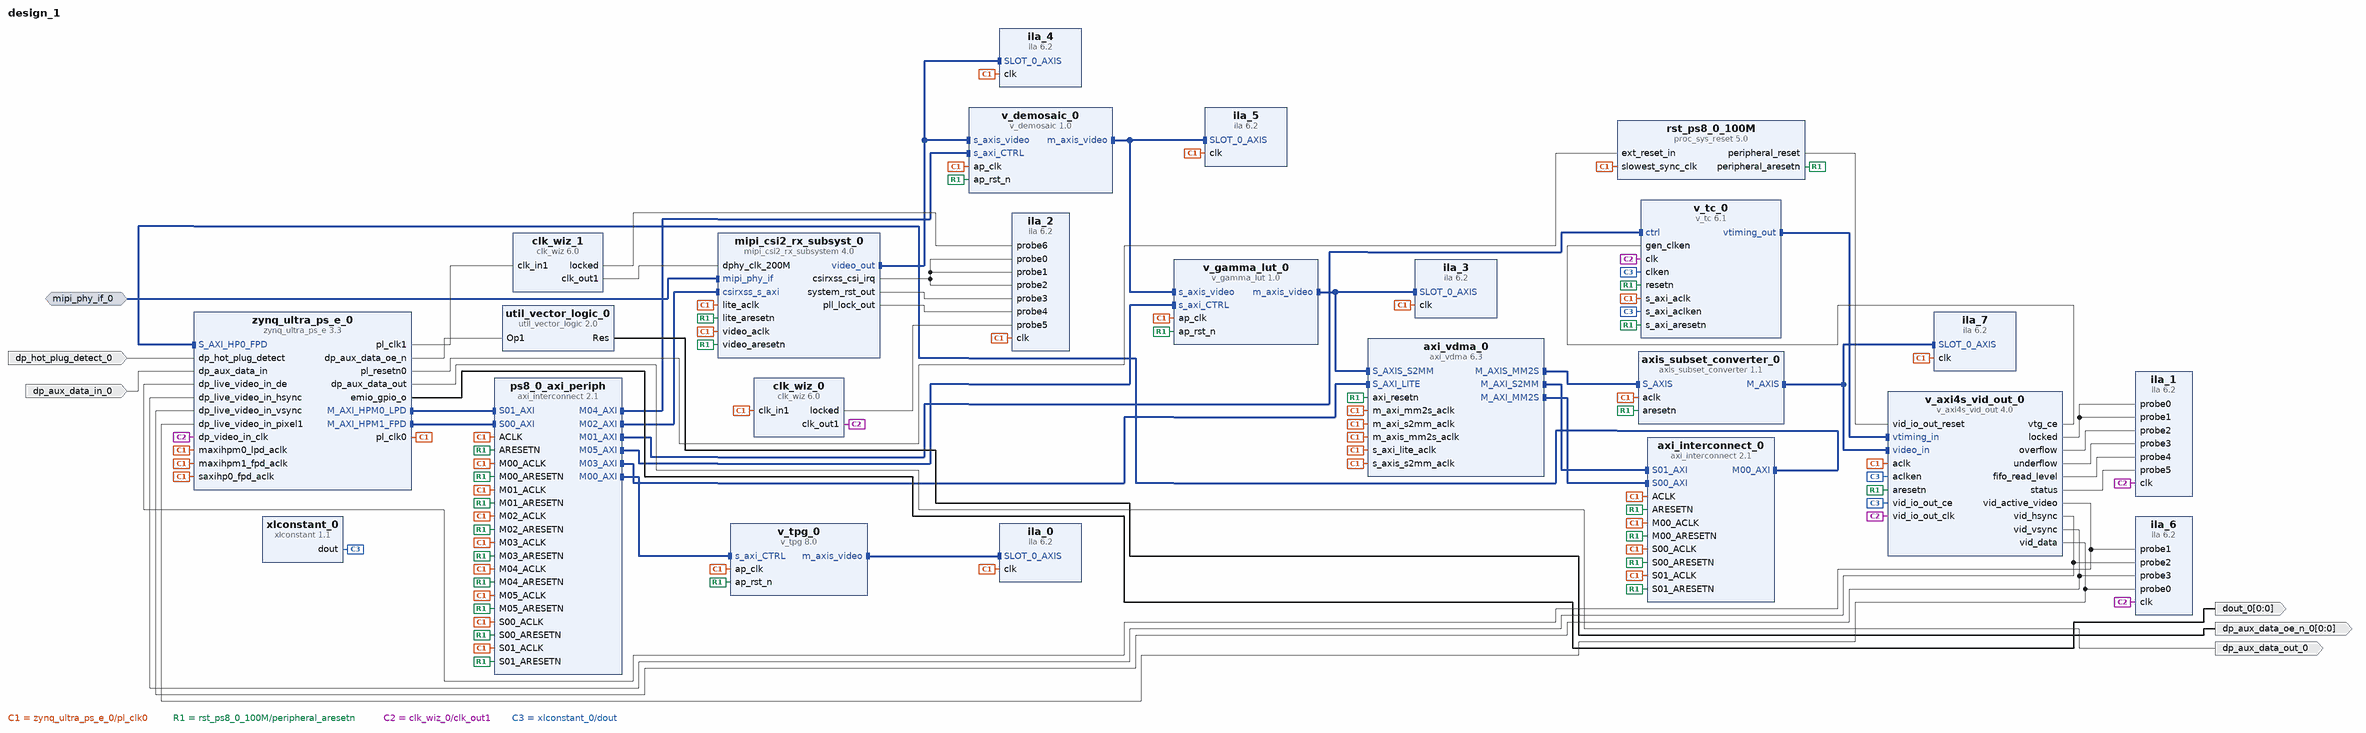
[diagram p0: block diagram of the top level]
# Vivado block design design_1, xczu3eg-sfvc784-1-e, Vivado 2019.1
create_bd_design design_1

create_bd_intf_port -mode Slave -vlnv xilinx.com:interface:mipi_phy_rtl:1.0 mipi_phy_if_0
create_bd_port -dir I dp_hot_plug_detect_0
create_bd_port -dir I dp_aux_data_in_0
create_bd_port -dir O dp_aux_data_out_0
create_bd_port -dir O -from 0 -to 0 dp_aux_data_oe_n_0
create_bd_port -dir O -from 0 -to 0 dout_0

create_bd_cell -type ip -vlnv xilinx.com:ip:clk_wiz:6.0 clk_wiz_0
set_property -dict [list \
  CONFIG.CLKIN1_JITTER_PS 66.66000000000001 \
  CONFIG.CLKOUT1_DRIVES Buffer \
  CONFIG.CLKOUT1_JITTER 220.922 \
  CONFIG.CLKOUT1_PHASE_ERROR 336.765 \
  CONFIG.CLKOUT1_REQUESTED_OUT_FREQ 74.250 \
  CONFIG.CLKOUT2_DRIVES Buffer \
  CONFIG.CLKOUT2_JITTER 151.155 \
  CONFIG.CLKOUT2_PHASE_ERROR 280.366 \
  CONFIG.CLKOUT2_REQUESTED_OUT_FREQ 200.000 \
  CONFIG.CLKOUT2_USED false \
  CONFIG.CLKOUT3_DRIVES Buffer \
  CONFIG.CLKOUT4_DRIVES Buffer \
  CONFIG.CLKOUT5_DRIVES Buffer \
  CONFIG.CLKOUT6_DRIVES Buffer \
  CONFIG.CLKOUT7_DRIVES Buffer \
  CONFIG.FEEDBACK_SOURCE FDBK_AUTO \
  CONFIG.MMCM_BANDWIDTH OPTIMIZED \
  CONFIG.MMCM_CLKFBOUT_MULT_F 61.875 \
  CONFIG.MMCM_CLKIN1_PERIOD 6.667 \
  CONFIG.MMCM_CLKIN2_PERIOD 10.0 \
  CONFIG.MMCM_CLKOUT0_DIVIDE_F 15.625 \
  CONFIG.MMCM_CLKOUT1_DIVIDE 1 \
  CONFIG.MMCM_COMPENSATION AUTO \
  CONFIG.MMCM_DIVCLK_DIVIDE 8 \
  CONFIG.NUM_OUT_CLKS 1 \
  CONFIG.PRIMITIVE MMCM \
  CONFIG.PRIM_IN_FREQ 150.000 \
  CONFIG.USE_RESET false \
] [get_bd_cells clk_wiz_0]
create_bd_cell -type ip -vlnv xilinx.com:ip:ila:6.2 ila_1
set_property -dict [list \
  CONFIG.C_ENABLE_ILA_AXI_MON false \
  CONFIG.C_MONITOR_TYPE Native \
  CONFIG.C_NUM_OF_PROBES 6 \
  CONFIG.C_PROBE4_WIDTH 11 \
  CONFIG.C_PROBE5_WIDTH 32 \
] [get_bd_cells ila_1]
create_bd_cell -type ip -vlnv xilinx.com:ip:axi_interconnect:2.1 ps8_0_axi_periph
set_property -dict {CONFIG.NUM_MI 6 CONFIG.NUM_SI 2} [get_bd_cells ps8_0_axi_periph]
create_bd_cell -type ip -vlnv xilinx.com:ip:proc_sys_reset:5.0 rst_ps8_0_100M
create_bd_cell -type ip -vlnv xilinx.com:ip:v_axi4s_vid_out:4.0 v_axi4s_vid_out_0
set_property -dict [list \
  CONFIG.C_ADDR_WIDTH 12 \
  CONFIG.C_HAS_ASYNC_CLK 1 \
  CONFIG.C_HYSTERESIS_LEVEL 12 \
  CONFIG.C_NATIVE_COMPONENT_WIDTH 12 \
  CONFIG.C_S_AXIS_VIDEO_DATA_WIDTH 10 \
  CONFIG.C_VTG_MASTER_SLAVE 0 \
] [get_bd_cells v_axi4s_vid_out_0]
create_bd_cell -type ip -vlnv xilinx.com:ip:v_tc:6.1 v_tc_0
set_property -dict {CONFIG.enable_detection false CONFIG.enable_generation true} [get_bd_cells v_tc_0]
create_bd_cell -type ip -vlnv xilinx.com:ip:v_tpg:8.0 v_tpg_0
set_property -dict {CONFIG.FOREGROUND 0 CONFIG.HAS_AXI4S_SLAVE 0 CONFIG.ZONE_PLATE 1} [get_bd_cells v_tpg_0]
create_bd_cell -type ip -vlnv xilinx.com:ip:xlconstant:1.1 xlconstant_0
create_bd_cell -type ip -vlnv xilinx.com:ip:zynq_ultra_ps_e:3.3 zynq_ultra_ps_e_0
set_property -dict [list \
  CONFIG.PSU_BANK_0_IO_STANDARD LVCMOS33 \
  CONFIG.PSU_BANK_1_IO_STANDARD LVCMOS18 \
  CONFIG.PSU_BANK_2_IO_STANDARD LVCMOS18 \
  CONFIG.PSU_BANK_3_IO_STANDARD LVCMOS33 \
  CONFIG.PSU_USB3__DUAL_CLOCK_ENABLE 1 \
  CONFIG.PSU__CRF_APB__DDR_CTRL__FREQMHZ 933 \
  CONFIG.PSU__CRF_APB__DPDMA_REF_CTRL__SRCSEL APLL \
  CONFIG.PSU__CRF_APB__DP_AUDIO_REF_CTRL__SRCSEL RPLL \
  CONFIG.PSU__CRF_APB__DP_STC_REF_CTRL__SRCSEL RPLL \
  CONFIG.PSU__CRF_APB__DP_VIDEO_REF_CTRL__SRCSEL VPLL \
  CONFIG.PSU__CRF_APB__GDMA_REF_CTRL__SRCSEL APLL \
  CONFIG.PSU__CRF_APB__GPU_REF_CTRL__SRCSEL IOPLL \
  CONFIG.PSU__CRF_APB__TOPSW_MAIN_CTRL__SRCSEL DPLL \
  CONFIG.PSU__CRL_APB__PL0_REF_CTRL__FREQMHZ 150 \
  CONFIG.PSU__CRL_APB__PL0_REF_CTRL__SRCSEL IOPLL \
  CONFIG.PSU__CRL_APB__PL1_REF_CTRL__FREQMHZ 50 \
  CONFIG.PSU__CRL_APB__PL1_REF_CTRL__SRCSEL IOPLL \
  CONFIG.PSU__CRL_APB__SDIO1_REF_CTRL__SRCSEL IOPLL \
  CONFIG.PSU__CRL_APB__USB3__ENABLE 1 \
  CONFIG.PSU__DDRC__COMPONENTS UDIMM \
  CONFIG.PSU__DDRC__DEVICE_CAPACITY {4096 MBits} \
  CONFIG.PSU__DDRC__SPEED_BIN DDR4_1866L \
  CONFIG.PSU__DDR_HIGH_ADDRESS_GUI_ENABLE 1 \
  CONFIG.PSU__DDR__INTERFACE__FREQMHZ 466.500 \
  CONFIG.PSU__DISPLAYPORT__LANE0__ENABLE 1 \
  CONFIG.PSU__DISPLAYPORT__LANE0__IO {GT Lane3} \
  CONFIG.PSU__DISPLAYPORT__LANE1__ENABLE 1 \
  CONFIG.PSU__DISPLAYPORT__LANE1__IO {GT Lane2} \
  CONFIG.PSU__DISPLAYPORT__PERIPHERAL__ENABLE 1 \
  CONFIG.PSU__DLL__ISUSED 1 \
  CONFIG.PSU__DPAUX__PERIPHERAL__ENABLE 1 \
  CONFIG.PSU__DPAUX__PERIPHERAL__IO EMIO \
  CONFIG.PSU__DP__LANE_SEL {Dual Higher} \
  CONFIG.PSU__DP__REF_CLK_FREQ 108 \
  CONFIG.PSU__DP__REF_CLK_SEL {Ref Clk2} \
  CONFIG.PSU__ENET0__GRP_MDIO__ENABLE 1 \
  CONFIG.PSU__ENET0__GRP_MDIO__IO {MIO 76 .. 77} \
  CONFIG.PSU__ENET0__PERIPHERAL__ENABLE 1 \
  CONFIG.PSU__ENET0__PERIPHERAL__IO {MIO 26 .. 37} \
  CONFIG.PSU__FPGA_PL1_ENABLE 1 \
  CONFIG.PSU__GEM__TSU__ENABLE 0 \
  CONFIG.PSU__GPIO0_MIO__IO {MIO 0 .. 25} \
  CONFIG.PSU__GPIO0_MIO__PERIPHERAL__ENABLE 1 \
  CONFIG.PSU__GPIO1_MIO__IO {MIO 26 .. 51} \
  CONFIG.PSU__GPIO1_MIO__PERIPHERAL__ENABLE 1 \
  CONFIG.PSU__GPIO_EMIO__PERIPHERAL__ENABLE 1 \
  CONFIG.PSU__GPIO_EMIO__PERIPHERAL__IO 1 \
  CONFIG.PSU__GT__LINK_SPEED HBR \
  CONFIG.PSU__GT__PRE_EMPH_LVL_4 0 \
  CONFIG.PSU__GT__VLT_SWNG_LVL_4 0 \
  CONFIG.PSU__I2C0__PERIPHERAL__ENABLE 1 \
  CONFIG.PSU__I2C0__PERIPHERAL__IO {MIO 22 .. 23} \
  CONFIG.PSU__I2C1__PERIPHERAL__ENABLE 1 \
  CONFIG.PSU__I2C1__PERIPHERAL__IO {MIO 8 .. 9} \
  CONFIG.PSU__PCIE__BAR0_VAL 0x0 \
  CONFIG.PSU__PCIE__BAR1_VAL 0x0 \
  CONFIG.PSU__PCIE__BAR2_VAL 0x0 \
  CONFIG.PSU__PCIE__BAR3_VAL 0x0 \
  CONFIG.PSU__PCIE__BAR4_VAL 0x0 \
  CONFIG.PSU__PCIE__BAR5_VAL 0x0 \
  CONFIG.PSU__PCIE__CLASS_CODE_BASE 0x06 \
  CONFIG.PSU__PCIE__CLASS_CODE_INTERFACE 0x0 \
  CONFIG.PSU__PCIE__CLASS_CODE_SUB 0x04 \
  CONFIG.PSU__PCIE__CLASS_CODE_VALUE 0x60400 \
  CONFIG.PSU__PCIE__DEVICE_ID 0xD011 \
  CONFIG.PSU__PCIE__DEVICE_PORT_TYPE {Root Port} \
  CONFIG.PSU__PCIE__EROM_VAL 0x0 \
  CONFIG.PSU__PCIE__LANE0__ENABLE 1 \
  CONFIG.PSU__PCIE__LANE0__IO {GT Lane0} \
  CONFIG.PSU__PCIE__LINK_SPEED {5.0 Gb/s} \
  CONFIG.PSU__PCIE__MAXIMUM_LINK_WIDTH x1 \
  CONFIG.PSU__PCIE__MAX_PAYLOAD_SIZE {256 bytes} \
  CONFIG.PSU__PCIE__PERIPHERAL__ENABLE 1 \
  CONFIG.PSU__PCIE__PERIPHERAL__ENDPOINT_ENABLE 0 \
  CONFIG.PSU__PCIE__PERIPHERAL__ROOTPORT_ENABLE 1 \
  CONFIG.PSU__PCIE__PERIPHERAL__ROOTPORT_IO {MIO 7} \
  CONFIG.PSU__PCIE__REF_CLK_FREQ 100 \
  CONFIG.PSU__PCIE__REF_CLK_SEL {Ref Clk0} \
  CONFIG.PSU__PCIE__REVISION_ID 0x0 \
  CONFIG.PSU__PCIE__SUBSYSTEM_ID 0x7 \
  CONFIG.PSU__PCIE__SUBSYSTEM_VENDOR_ID 0x10EE \
  CONFIG.PSU__PCIE__VENDOR_ID 0x10EE \
  CONFIG.PSU__PRESET_APPLIED 1 \
  CONFIG.PSU__PSS_REF_CLK__FREQMHZ 30 \
  CONFIG.PSU__QSPI_COHERENCY 0 \
  CONFIG.PSU__QSPI_ROUTE_THROUGH_FPD 0 \
  CONFIG.PSU__QSPI__GRP_FBCLK__ENABLE 1 \
  CONFIG.PSU__QSPI__GRP_FBCLK__IO {MIO 6} \
  CONFIG.PSU__QSPI__PERIPHERAL__DATA_MODE x4 \
  CONFIG.PSU__QSPI__PERIPHERAL__ENABLE 1 \
  CONFIG.PSU__QSPI__PERIPHERAL__IO {MIO 0 .. 5} \
  CONFIG.PSU__QSPI__PERIPHERAL__MODE Single \
  CONFIG.PSU__SD1_COHERENCY 0 \
  CONFIG.PSU__SD1_ROUTE_THROUGH_FPD 0 \
  CONFIG.PSU__SD1__DATA_TRANSFER_MODE 8Bit \
  CONFIG.PSU__SD1__GRP_CD__ENABLE 1 \
  CONFIG.PSU__SD1__GRP_CD__IO {MIO 45} \
  CONFIG.PSU__SD1__GRP_POW__ENABLE 1 \
  CONFIG.PSU__SD1__GRP_POW__IO {MIO 43} \
  CONFIG.PSU__SD1__GRP_WP__ENABLE 0 \
  CONFIG.PSU__SD1__PERIPHERAL__ENABLE 1 \
  CONFIG.PSU__SD1__PERIPHERAL__IO {MIO 39 .. 51} \
  CONFIG.PSU__SD1__SLOT_TYPE {SD 3.0} \
  CONFIG.PSU__SPI0__GRP_SS0__IO {MIO 15} \
  CONFIG.PSU__SPI0__GRP_SS1__ENABLE 1 \
  CONFIG.PSU__SPI0__GRP_SS1__IO {MIO 14} \
  CONFIG.PSU__SPI0__PERIPHERAL__ENABLE 1 \
  CONFIG.PSU__SPI0__PERIPHERAL__IO {MIO 12 .. 17} \
  CONFIG.PSU__TSU__BUFG_PORT_PAIR 0 \
  CONFIG.PSU__TTC0__CLOCK__ENABLE 0 \
  CONFIG.PSU__TTC0__PERIPHERAL__ENABLE 1 \
  CONFIG.PSU__TTC0__WAVEOUT__ENABLE 0 \
  CONFIG.PSU__UART0__BAUD_RATE 115200 \
  CONFIG.PSU__UART0__MODEM__ENABLE 0 \
  CONFIG.PSU__UART0__PERIPHERAL__ENABLE 1 \
  CONFIG.PSU__UART0__PERIPHERAL__IO {MIO 18 .. 19} \
  CONFIG.PSU__UART1__BAUD_RATE 115200 \
  CONFIG.PSU__UART1__MODEM__ENABLE 0 \
  CONFIG.PSU__UART1__PERIPHERAL__ENABLE 1 \
  CONFIG.PSU__UART1__PERIPHERAL__IO EMIO \
  CONFIG.PSU__USB0_COHERENCY 0 \
  CONFIG.PSU__USB0__PERIPHERAL__ENABLE 1 \
  CONFIG.PSU__USB0__PERIPHERAL__IO {MIO 52 .. 63} \
  CONFIG.PSU__USB0__REF_CLK_FREQ 100 \
  CONFIG.PSU__USB0__REF_CLK_SEL {Ref Clk0} \
  CONFIG.PSU__USB1__PERIPHERAL__ENABLE 1 \
  CONFIG.PSU__USB1__PERIPHERAL__IO {MIO 64 .. 75} \
  CONFIG.PSU__USB2_0__EMIO__ENABLE 0 \
  CONFIG.PSU__USB3_0__EMIO__ENABLE 0 \
  CONFIG.PSU__USB3_0__PERIPHERAL__ENABLE 1 \
  CONFIG.PSU__USB3_0__PERIPHERAL__IO {GT Lane1} \
  CONFIG.PSU__USB__RESET__MODE Disable \
  CONFIG.PSU__USE__IRQ0 1 \
  CONFIG.PSU__USE__M_AXI_GP1 1 \
  CONFIG.PSU__USE__S_AXI_GP2 1 \
  CONFIG.PSU__USE__VIDEO 1 \
  CONFIG.SUBPRESET1 Custom \
] [get_bd_cells zynq_ultra_ps_e_0]
# 194 more settings of zynq_ultra_ps_e_0 are not shown: defaults, MIO pin electricals, DDR timing, and values the tool derives
create_bd_cell -type ip -vlnv xilinx.com:ip:util_vector_logic:2.0 util_vector_logic_0
set_property -dict {CONFIG.C_OPERATION not CONFIG.C_SIZE 1} [get_bd_cells util_vector_logic_0]
create_bd_cell -type ip -vlnv xilinx.com:ip:mipi_csi2_rx_subsystem:4.0 mipi_csi2_rx_subsyst_0
set_property -dict [list \
  CONFIG.CLK_LANE_IO_LOC G1 \
  CONFIG.CMN_INC_VFB true \
  CONFIG.CMN_NUM_LANES 2 \
  CONFIG.CMN_PXL_FORMAT RAW10 \
  CONFIG.C_CSI_EN_ACTIVELANES true \
  CONFIG.C_DPHY_LANES 2 \
  CONFIG.C_EN_CSI_V2_0 true \
  CONFIG.C_HS_LINE_RATE 280 \
  CONFIG.C_HS_SETTLE_NS 170 \
  CONFIG.DATA_LANE0_IO_LOC E1 \
  CONFIG.DATA_LANE1_IO_LOC F2 \
  CONFIG.DPY_LINE_RATE 280 \
  CONFIG.HP_IO_BANK_SELECTION 66 \
  CONFIG.SupportLevel 1 \
] [get_bd_cells mipi_csi2_rx_subsyst_0]
create_bd_cell -type ip -vlnv xilinx.com:ip:ila:6.2 ila_2
set_property -dict {CONFIG.C_ENABLE_ILA_AXI_MON false CONFIG.C_MONITOR_TYPE Native CONFIG.C_NUM_OF_PROBES 7} [get_bd_cells ila_2]
create_bd_cell -type ip -vlnv xilinx.com:ip:ila:6.2 ila_3
set_property -dict {CONFIG.C_NUM_OF_PROBES 9 CONFIG.C_SLOT_0_AXI_PROTOCOL AXI4S} [get_bd_cells ila_3]
create_bd_cell -type ip -vlnv xilinx.com:ip:clk_wiz:6.0 clk_wiz_1
set_property -dict [list \
  CONFIG.CLKOUT1_JITTER 124.134 \
  CONFIG.CLKOUT1_REQUESTED_OUT_FREQ 200.000 \
  CONFIG.MMCM_CLKOUT0_DIVIDE_F 6.000 \
  CONFIG.USE_RESET false \
] [get_bd_cells clk_wiz_1]
create_bd_cell -type ip -vlnv xilinx.com:ip:axi_vdma:6.3 axi_vdma_0
set_property -dict [list \
  CONFIG.c_include_mm2s_dre 1 \
  CONFIG.c_include_s2mm_dre 1 \
  CONFIG.c_m_axis_mm2s_tdata_width 32 \
  CONFIG.c_mm2s_linebuffer_depth 2048 \
  CONFIG.c_mm2s_max_burst_length 64 \
  CONFIG.c_num_fstores 1 \
  CONFIG.c_s2mm_linebuffer_depth 2048 \
  CONFIG.c_s2mm_max_burst_length 64 \
  CONFIG.c_use_s2mm_fsync 0 \
] [get_bd_cells axi_vdma_0]
create_bd_cell -type ip -vlnv xilinx.com:ip:axi_interconnect:2.1 axi_interconnect_0
set_property -dict {CONFIG.NUM_MI 1 CONFIG.NUM_SI 2} [get_bd_cells axi_interconnect_0]
create_bd_cell -type ip -vlnv xilinx.com:ip:ila:6.2 ila_0
set_property -dict {CONFIG.C_DATA_DEPTH 2048 CONFIG.C_NUM_OF_PROBES 9 CONFIG.C_SLOT_0_AXI_PROTOCOL AXI4S} [get_bd_cells ila_0]
create_bd_cell -type ip -vlnv xilinx.com:ip:v_demosaic:1.0 v_demosaic_0
set_property -dict [list \
  CONFIG.ALGORITHM 1 \
  CONFIG.MAX_COLS 2048 \
  CONFIG.MAX_DATA_WIDTH 10 \
  CONFIG.MAX_ROWS 1024 \
] [get_bd_cells v_demosaic_0]
create_bd_cell -type ip -vlnv xilinx.com:ip:v_gamma_lut:1.0 v_gamma_lut_0
set_property -dict {CONFIG.MAX_COLS 2048 CONFIG.MAX_DATA_WIDTH 10 CONFIG.MAX_ROWS 1024} [get_bd_cells v_gamma_lut_0]
create_bd_cell -type ip -vlnv xilinx.com:ip:axis_subset_converter:1.1 axis_subset_converter_0
set_property -dict {CONFIG.TDATA_REMAP {tdata[31:30],tdata[19:10],tdata[29:20],tdata[9:0]}} [get_bd_cells axis_subset_converter_0]
create_bd_cell -type ip -vlnv xilinx.com:ip:ila:6.2 ila_4
set_property -dict {CONFIG.C_DATA_DEPTH 2048 CONFIG.C_NUM_OF_PROBES 9 CONFIG.C_SLOT_0_AXI_PROTOCOL AXI4S} [get_bd_cells ila_4]
create_bd_cell -type ip -vlnv xilinx.com:ip:ila:6.2 ila_5
set_property -dict {CONFIG.C_DATA_DEPTH 2048 CONFIG.C_NUM_OF_PROBES 9 CONFIG.C_SLOT_0_AXI_PROTOCOL AXI4S} [get_bd_cells ila_5]
create_bd_cell -type ip -vlnv xilinx.com:ip:ila:6.2 ila_6
set_property -dict [list \
  CONFIG.C_ENABLE_ILA_AXI_MON false \
  CONFIG.C_MONITOR_TYPE Native \
  CONFIG.C_NUM_OF_PROBES 4 \
  CONFIG.C_PROBE0_WIDTH 36 \
] [get_bd_cells ila_6]
create_bd_cell -type ip -vlnv xilinx.com:ip:ila:6.2 ila_7
set_property -dict {CONFIG.C_DATA_DEPTH 2048 CONFIG.C_NUM_OF_PROBES 9 CONFIG.C_SLOT_0_AXI_PROTOCOL AXI4S} [get_bd_cells ila_7]

# ---- connections ----

connect_bd_intf_net [get_bd_intf_pins axi_vdma_0/M_AXI_S2MM] [get_bd_intf_pins axi_interconnect_0/S01_AXI]
connect_bd_intf_net -intf_net zynq_ultra_ps_e_1_M_AXI_HPM0_LPD [get_bd_intf_pins zynq_ultra_ps_e_0/M_AXI_HPM0_LPD] [get_bd_intf_pins ps8_0_axi_periph/S01_AXI]
connect_bd_intf_net [get_bd_intf_pins ps8_0_axi_periph/M01_AXI] [get_bd_intf_pins v_tc_0/ctrl]
connect_bd_intf_net [get_bd_intf_pins ps8_0_axi_periph/M02_AXI] [get_bd_intf_pins mipi_csi2_rx_subsyst_0/csirxss_s_axi]
connect_bd_intf_net [get_bd_intf_pins ps8_0_axi_periph/M05_AXI] [get_bd_intf_pins v_gamma_lut_0/s_axi_CTRL]
connect_bd_intf_net [get_bd_intf_pins axi_interconnect_0/M00_AXI] [get_bd_intf_pins zynq_ultra_ps_e_0/S_AXI_HP0_FPD]
connect_bd_intf_net [get_bd_intf_pins ps8_0_axi_periph/M04_AXI] [get_bd_intf_pins v_demosaic_0/s_axi_CTRL]
connect_bd_intf_net [get_bd_intf_pins ps8_0_axi_periph/M03_AXI] [get_bd_intf_pins axi_vdma_0/S_AXI_LITE]
connect_bd_intf_net [get_bd_intf_pins v_demosaic_0/m_axis_video] [get_bd_intf_pins v_gamma_lut_0/s_axis_video]
connect_bd_intf_net [get_bd_intf_pins v_demosaic_0/m_axis_video] [get_bd_intf_pins ila_5/SLOT_0_AXIS]
connect_bd_intf_net [get_bd_intf_pins v_tc_0/vtiming_out] [get_bd_intf_pins v_axi4s_vid_out_0/vtiming_in]
connect_bd_intf_net [get_bd_intf_pins axi_vdma_0/M_AXI_MM2S] [get_bd_intf_pins axi_interconnect_0/S00_AXI]
connect_bd_intf_net [get_bd_intf_pins v_demosaic_0/s_axis_video] [get_bd_intf_pins mipi_csi2_rx_subsyst_0/video_out]
connect_bd_intf_net [get_bd_intf_pins v_demosaic_0/s_axis_video] [get_bd_intf_pins ila_4/SLOT_0_AXIS]
connect_bd_intf_net -intf_net mipi_phy_if_0_1 [get_bd_intf_ports mipi_phy_if_0] [get_bd_intf_pins mipi_csi2_rx_subsyst_0/mipi_phy_if]
connect_bd_intf_net -intf_net v_demosaic_0_m_axis_video [get_bd_intf_pins v_gamma_lut_0/m_axis_video] [get_bd_intf_pins axi_vdma_0/S_AXIS_S2MM]
connect_bd_intf_net [get_bd_intf_pins v_gamma_lut_0/m_axis_video] [get_bd_intf_pins ila_3/SLOT_0_AXIS]
connect_bd_intf_net [get_bd_intf_pins ps8_0_axi_periph/M00_AXI] [get_bd_intf_pins v_tpg_0/s_axi_CTRL]
connect_bd_intf_net -intf_net zynq_ultra_ps_e_1_M_AXI_HPM1_FPD [get_bd_intf_pins zynq_ultra_ps_e_0/M_AXI_HPM1_FPD] [get_bd_intf_pins ps8_0_axi_periph/S00_AXI]
connect_bd_intf_net [get_bd_intf_pins axi_vdma_0/M_AXIS_MM2S] [get_bd_intf_pins axis_subset_converter_0/S_AXIS]
connect_bd_intf_net [get_bd_intf_pins axis_subset_converter_0/M_AXIS] [get_bd_intf_pins v_axi4s_vid_out_0/video_in]
connect_bd_intf_net [get_bd_intf_pins axis_subset_converter_0/M_AXIS] [get_bd_intf_pins ila_7/SLOT_0_AXIS]
connect_bd_intf_net [get_bd_intf_pins v_tpg_0/m_axis_video] [get_bd_intf_pins ila_0/SLOT_0_AXIS]
connect_bd_net [get_bd_pins zynq_ultra_ps_e_0/pl_clk0] \
  [get_bd_pins clk_wiz_0/clk_in1] [get_bd_pins ps8_0_axi_periph/ACLK] [get_bd_pins ps8_0_axi_periph/S00_ACLK] \
  [get_bd_pins ps8_0_axi_periph/S01_ACLK] [get_bd_pins ps8_0_axi_periph/M00_ACLK] [get_bd_pins ps8_0_axi_periph/M01_ACLK] \
  [get_bd_pins rst_ps8_0_100M/slowest_sync_clk] [get_bd_pins v_tc_0/s_axi_aclk] [get_bd_pins v_tpg_0/ap_clk] \
  [get_bd_pins zynq_ultra_ps_e_0/maxihpm1_fpd_aclk] [get_bd_pins mipi_csi2_rx_subsyst_0/lite_aclk] \
  [get_bd_pins ps8_0_axi_periph/M02_ACLK] [get_bd_pins ila_2/clk] [get_bd_pins zynq_ultra_ps_e_0/maxihpm0_lpd_aclk] \
  [get_bd_pins ps8_0_axi_periph/M03_ACLK] [get_bd_pins mipi_csi2_rx_subsyst_0/video_aclk] [get_bd_pins ila_3/clk] \
  [get_bd_pins axi_vdma_0/s_axi_lite_aclk] [get_bd_pins axi_interconnect_0/ACLK] [get_bd_pins v_axi4s_vid_out_0/aclk] \
  [get_bd_pins axi_interconnect_0/S00_ACLK] [get_bd_pins axi_interconnect_0/M00_ACLK] \
  [get_bd_pins axi_interconnect_0/S01_ACLK] [get_bd_pins axi_vdma_0/m_axi_mm2s_aclk] \
  [get_bd_pins axi_vdma_0/m_axis_mm2s_aclk] [get_bd_pins axi_vdma_0/m_axi_s2mm_aclk] \
  [get_bd_pins axi_vdma_0/s_axis_s2mm_aclk] [get_bd_pins zynq_ultra_ps_e_0/saxihp0_fpd_aclk] [get_bd_pins ila_0/clk] \
  [get_bd_pins v_demosaic_0/ap_clk] [get_bd_pins ps8_0_axi_periph/M04_ACLK] [get_bd_pins v_gamma_lut_0/ap_clk] \
  [get_bd_pins ps8_0_axi_periph/M05_ACLK] [get_bd_pins axis_subset_converter_0/aclk] [get_bd_pins ila_4/clk] \
  [get_bd_pins ila_5/clk] [get_bd_pins ila_7/clk]
connect_bd_net [get_bd_pins rst_ps8_0_100M/peripheral_aresetn] \
  [get_bd_pins ps8_0_axi_periph/ARESETN] [get_bd_pins ps8_0_axi_periph/S00_ARESETN] \
  [get_bd_pins ps8_0_axi_periph/S01_ARESETN] [get_bd_pins ps8_0_axi_periph/M00_ARESETN] \
  [get_bd_pins ps8_0_axi_periph/M01_ARESETN] [get_bd_pins v_axi4s_vid_out_0/aresetn] [get_bd_pins v_tc_0/resetn] \
  [get_bd_pins v_tc_0/s_axi_aresetn] [get_bd_pins v_tpg_0/ap_rst_n] [get_bd_pins mipi_csi2_rx_subsyst_0/lite_aresetn] \
  [get_bd_pins ps8_0_axi_periph/M02_ARESETN] [get_bd_pins mipi_csi2_rx_subsyst_0/video_aresetn] \
  [get_bd_pins axi_vdma_0/axi_resetn] [get_bd_pins axi_interconnect_0/ARESETN] [get_bd_pins ps8_0_axi_periph/M03_ARESETN] \
  [get_bd_pins axi_interconnect_0/S00_ARESETN] [get_bd_pins axi_interconnect_0/M00_ARESETN] \
  [get_bd_pins axi_interconnect_0/S01_ARESETN] [get_bd_pins v_demosaic_0/ap_rst_n] [get_bd_pins ps8_0_axi_periph/M04_ARESETN] \
  [get_bd_pins v_gamma_lut_0/ap_rst_n] [get_bd_pins ps8_0_axi_periph/M05_ARESETN] \
  [get_bd_pins axis_subset_converter_0/aresetn]
connect_bd_net [get_bd_pins clk_wiz_0/clk_out1] \
  [get_bd_pins ila_1/clk] [get_bd_pins v_axi4s_vid_out_0/vid_io_out_clk] [get_bd_pins v_tc_0/clk] \
  [get_bd_pins zynq_ultra_ps_e_0/dp_video_in_clk] [get_bd_pins ila_6/clk]
connect_bd_net [get_bd_pins xlconstant_0/dout] \
  [get_bd_pins v_axi4s_vid_out_0/aclken] [get_bd_pins v_axi4s_vid_out_0/vid_io_out_ce] [get_bd_pins v_tc_0/clken] \
  [get_bd_pins v_tc_0/s_axi_aclken]
connect_bd_net [get_bd_pins rst_ps8_0_100M/peripheral_reset] [get_bd_pins v_axi4s_vid_out_0/vid_io_out_reset]
connect_bd_net [get_bd_pins v_axi4s_vid_out_0/locked] [get_bd_pins ila_1/probe1] [get_bd_pins ila_1/probe0]
connect_bd_net [get_bd_pins v_axi4s_vid_out_0/overflow] [get_bd_pins ila_1/probe2]
connect_bd_net [get_bd_pins v_axi4s_vid_out_0/underflow] [get_bd_pins ila_1/probe3]
connect_bd_net [get_bd_pins v_axi4s_vid_out_0/fifo_read_level] [get_bd_pins ila_1/probe4]
connect_bd_net [get_bd_pins v_axi4s_vid_out_0/status] [get_bd_pins ila_1/probe5]
connect_bd_net [get_bd_pins v_axi4s_vid_out_0/vid_active_video] [get_bd_pins zynq_ultra_ps_e_0/dp_live_video_in_de] [get_bd_pins ila_6/probe1]
connect_bd_net [get_bd_pins v_axi4s_vid_out_0/vid_hsync] [get_bd_pins zynq_ultra_ps_e_0/dp_live_video_in_hsync] [get_bd_pins ila_6/probe2]
connect_bd_net [get_bd_pins v_axi4s_vid_out_0/vid_vsync] [get_bd_pins zynq_ultra_ps_e_0/dp_live_video_in_vsync] [get_bd_pins ila_6/probe3]
connect_bd_net -net zynq_ultra_ps_e_1_pl_resetn0 [get_bd_pins zynq_ultra_ps_e_0/pl_resetn0] [get_bd_pins rst_ps8_0_100M/ext_reset_in]
connect_bd_net -net dp_hot_plug_detect_0_1 [get_bd_ports dp_hot_plug_detect_0] [get_bd_pins zynq_ultra_ps_e_0/dp_hot_plug_detect]
connect_bd_net -net dp_aux_data_in_0_1 [get_bd_ports dp_aux_data_in_0] [get_bd_pins zynq_ultra_ps_e_0/dp_aux_data_in]
connect_bd_net [get_bd_pins zynq_ultra_ps_e_0/dp_aux_data_out] [get_bd_ports dp_aux_data_out_0]
connect_bd_net [get_bd_pins util_vector_logic_0/Res] [get_bd_ports dp_aux_data_oe_n_0]
connect_bd_net [get_bd_pins zynq_ultra_ps_e_0/dp_aux_data_oe_n] [get_bd_pins util_vector_logic_0/Op1]
connect_bd_net [get_bd_pins mipi_csi2_rx_subsyst_0/csirxss_csi_irq] [get_bd_pins ila_2/probe1] [get_bd_pins ila_2/probe0] [get_bd_pins ila_2/probe2]
connect_bd_net [get_bd_pins mipi_csi2_rx_subsyst_0/system_rst_out] [get_bd_pins ila_2/probe3]
connect_bd_net [get_bd_pins mipi_csi2_rx_subsyst_0/pll_lock_out] [get_bd_pins ila_2/probe4]
connect_bd_net [get_bd_pins zynq_ultra_ps_e_0/pl_clk1] [get_bd_pins clk_wiz_1/clk_in1]
connect_bd_net [get_bd_pins clk_wiz_1/clk_out1] [get_bd_pins mipi_csi2_rx_subsyst_0/dphy_clk_200M]
connect_bd_net [get_bd_pins clk_wiz_0/locked] [get_bd_pins ila_2/probe5]
connect_bd_net [get_bd_pins clk_wiz_1/locked] [get_bd_pins ila_2/probe6]
connect_bd_net [get_bd_pins zynq_ultra_ps_e_0/emio_gpio_o] [get_bd_ports dout_0]
connect_bd_net [get_bd_pins v_axi4s_vid_out_0/vtg_ce] [get_bd_pins v_tc_0/gen_clken]
connect_bd_net [get_bd_pins v_axi4s_vid_out_0/vid_data] [get_bd_pins zynq_ultra_ps_e_0/dp_live_video_in_pixel1] [get_bd_pins ila_6/probe0]

# ---- address map ----
assign_bd_address -offset 0x00000000 -range 2G -target_address_space [get_bd_addr_spaces axi_vdma_0/Data_MM2S] [get_bd_addr_segs zynq_ultra_ps_e_0/SAXIGP2/HP0_DDR_LOW]
assign_bd_address -offset 0xC0000000 -range 512M -target_address_space [get_bd_addr_spaces axi_vdma_0/Data_MM2S] [get_bd_addr_segs zynq_ultra_ps_e_0/SAXIGP2/HP0_QSPI]
assign_bd_address -offset 0xE0000000 -range 256M -target_address_space [get_bd_addr_spaces axi_vdma_0/Data_MM2S] [get_bd_addr_segs zynq_ultra_ps_e_0/SAXIGP2/HP0_PCIE_LOW]
assign_bd_address -offset 0xFF000000 -range 16M -target_address_space [get_bd_addr_spaces axi_vdma_0/Data_MM2S] [get_bd_addr_segs zynq_ultra_ps_e_0/SAXIGP2/HP0_LPS_OCM]
assign_bd_address -offset 0x00000000 -range 2G -target_address_space [get_bd_addr_spaces axi_vdma_0/Data_S2MM] [get_bd_addr_segs zynq_ultra_ps_e_0/SAXIGP2/HP0_DDR_LOW]
assign_bd_address -offset 0xC0000000 -range 512M -target_address_space [get_bd_addr_spaces axi_vdma_0/Data_S2MM] [get_bd_addr_segs zynq_ultra_ps_e_0/SAXIGP2/HP0_QSPI]
assign_bd_address -offset 0xE0000000 -range 256M -target_address_space [get_bd_addr_spaces axi_vdma_0/Data_S2MM] [get_bd_addr_segs zynq_ultra_ps_e_0/SAXIGP2/HP0_PCIE_LOW]
assign_bd_address -offset 0xFF000000 -range 16M -target_address_space [get_bd_addr_spaces axi_vdma_0/Data_S2MM] [get_bd_addr_segs zynq_ultra_ps_e_0/SAXIGP2/HP0_LPS_OCM]
assign_bd_address -offset 0x00B0000000 -range 64K -target_address_space [get_bd_addr_spaces zynq_ultra_ps_e_0/Data] [get_bd_addr_segs v_tc_0/ctrl/Reg]
assign_bd_address -offset 0x00B0010000 -range 64K -target_address_space [get_bd_addr_spaces zynq_ultra_ps_e_0/Data] [get_bd_addr_segs v_tpg_0/s_axi_CTRL/Reg]
assign_bd_address -offset 0x00B0020000 -range 64K -target_address_space [get_bd_addr_spaces zynq_ultra_ps_e_0/Data] [get_bd_addr_segs mipi_csi2_rx_subsyst_0/csirxss_s_axi/Reg]
assign_bd_address -offset 0x00B0030000 -range 4K -target_address_space [get_bd_addr_spaces zynq_ultra_ps_e_0/Data] [get_bd_addr_segs axi_vdma_0/S_AXI_LITE/Reg]
assign_bd_address -offset 0x00B0040000 -range 64K -target_address_space [get_bd_addr_spaces zynq_ultra_ps_e_0/Data] [get_bd_addr_segs v_demosaic_0/s_axi_CTRL/Reg]
assign_bd_address -offset 0x00B0050000 -range 64K -target_address_space [get_bd_addr_spaces zynq_ultra_ps_e_0/Data] [get_bd_addr_segs v_gamma_lut_0/s_axi_CTRL/Reg]

validate_bd_design
save_bd_design
